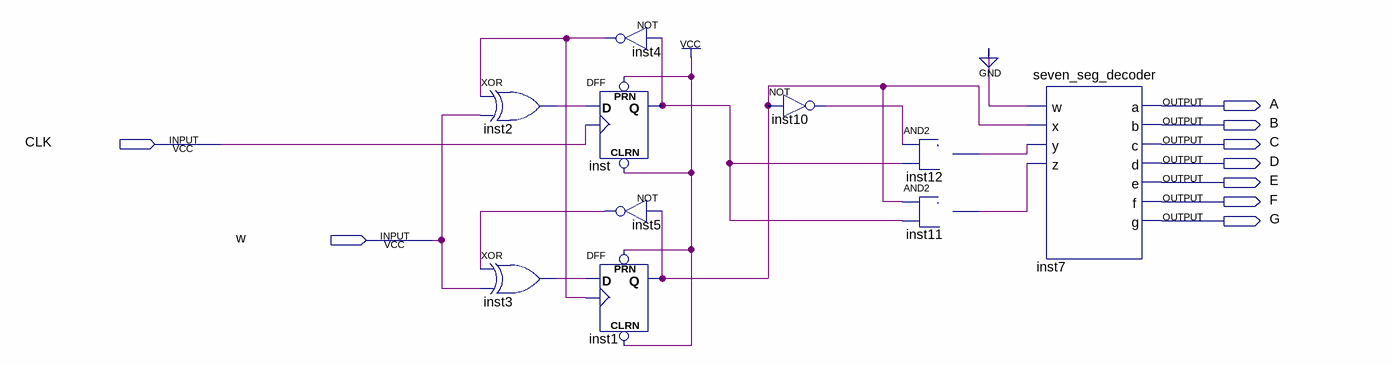
[diagram p0: schematic sheet]
// Quartus schematic lab11step1.bdf as structural Verilog: 10 symbols, 9 pins
module lab11step1 (
  input  CLK,
  input  w,
  output A,
  output B,
  output C,
  output D,
  output E,
  output F,
  output G
);

  wire inst1_q, inst2_out, inst3_out, inst4_out, inst5_out, inst10_out, inst11_out, inst12_out, inst_q;

  xor inst2 (inst2_out, inst4_out, w);
  xor inst3 (inst3_out, inst5_out, w);
  not inst4 (inst4_out, inst_q);
  DFF inst (.CLRN(1'b1), .CLK(CLK), .D(inst2_out), .PRN(1'b1), .Q(inst_q));
  not inst5 (inst5_out, inst1_q);
  DFF inst1 (.CLRN(1'b1), .CLK(inst4_out), .D(inst3_out), .PRN(1'b1), .Q(inst1_q));
  not inst10 (inst10_out, inst1_q);
  and inst12 (inst12_out, inst10_out, inst_q);
  and inst11 (inst11_out, inst1_q, inst_q);
  seven_seg_decoder inst7 (
    .w(1'b0), .x(inst1_q), .y(inst12_out), .z(inst11_out), .a(A), .b(B), .c(C), .d(D), .e(E), .f(F), .g(G));
endmodule
